# EAGLE design D1 Breakout - LCD TH Dupont (EAGLE 7.3.0)
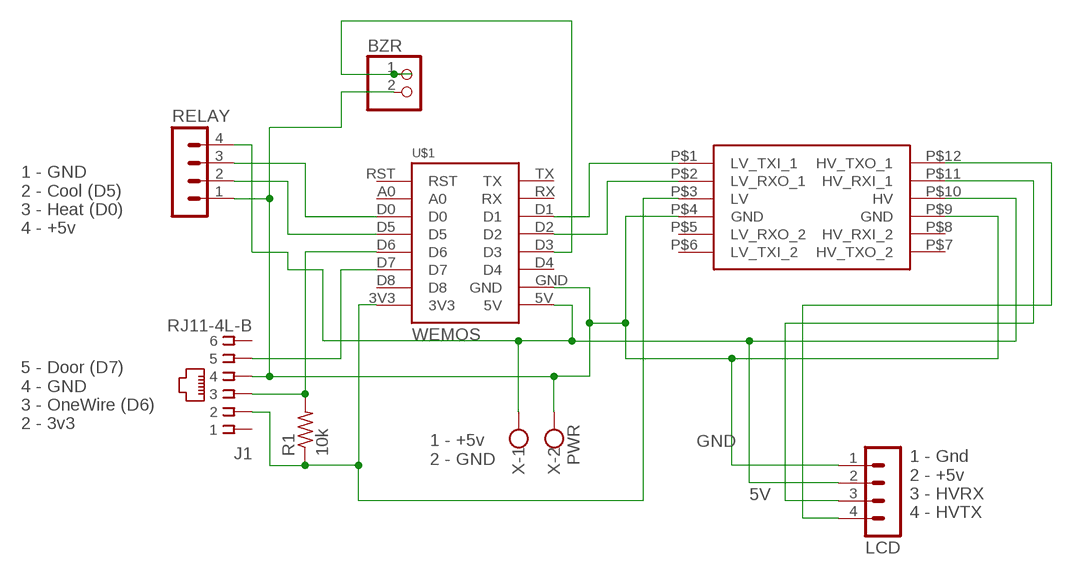
[diagram p0: schematic, sheet 1]

## Parts
BZR  PINHD-1X2  [1X02]
J1  RJ11-4L-B  [RJ11-NO_SHIELD]
LCD  MA04-1  [MA04-1]
R1  10k  R-US_0207/5V  [0207/5V]
RELAY  MA04-1  [MA04-1]
U$1  WEMOS  [WEMOS]
U$3  LOGIC_LEVEL_CONVERTER  [LOGIC_LEVEL_CONVERTER]
X  PWR  W237-102  [W237-102]

## Nets
5V [5v]: LCD.2 RELAY.4 U$1.5V U$3.P$10(HV) X.1
D6: J1.3 R1.2 U$1.D6
D7: J1.5 U$1.D7
GND [Gnd]: BZR.2 J1.4 LCD.1 RELAY.1 U$1.GND U$3.P$4(GND) U$3.P$9(GND) X.2
N$1: U$1.D1 U$3.P$1(LV_TXI_1)
N$2: U$1.D2 U$3.P$2(LV_RXO_1)
N$3 [3v]: J1.2 R1.1 U$1.3V3 U$3.P$3(LV)
N$4: LCD.4 U$3.P$12(HV_TXO_1)
N$5: LCD.3 U$3.P$11(HV_RXI_1)
N$6: BZR.1 U$1.D3
N$7: RELAY.2 U$1.D5
N$8: RELAY.3 U$1.D0
Unconnected: J1.1 J1.6 U$1.A0 U$1.D4 U$1.D8 U$1.RST U$1.RX U$1.TX U$3.P$5(LV_RXO_2) U$3.P$6(LV_TXI_2) U$3.P$7(HV_TXO_2) U$3.P$8(HV_RXI_2)

## Notes on the sheet
- 1 - GND
  2 - Cool (D5)
  3 - Heat (D0)
  4 - +5v
- 5 - Door (D7)
  4 - GND
  3 - OneWire (D6) 
  2 - 3v3
- 1 - +5v
  2 - GND
- 1 - Gnd
  2 - +5v
  3 - HVRX
  4 - HVTX

## Library data of the parts
BZR = pinhead:PINHD-1X2: PIN HEADER
J1 = con-tycoelectronics:RJ11: CORCOM Modular RJ Jacks No Shield Source: www.tycoelectronics.com .. ENG_DS_1654001_1099_RJ_L_0507.pdf; MF: TYCO ELECTRONICS; MPN: RJ11-4L-B; OC_FARNELL: unknown; OC_NEWARK: 52K3315
LCD RELAY = con-lstb:MA04-1: PIN HEADER; OC_FARNELL: unknown; OC_NEWARK: unknown
R1 = rcl:R-US_: RESISTOR, American symbol
U$1 = 1455413453956-wemos:WEMOS
U$3 = SparkFun-Boards:LOGIC_LEVEL_CONVERTER: Logic Level Converter (3.3v - 5v) https://www.sparkfun.com/products/8745
X = con-wago-500:W237-102: WAGO SCREW CLAMP; MPN: 237-102; OC_FARNELL: unknown; OC_NEWARK: 70K9898

## Net classes
0 default: width 0.305 mm, clearance 0.305 mm
1 5v: width 0.406 mm, clearance 0.406 mm
2 3v: width 0.406 mm, clearance 0.406 mm
3 Gnd: width 0.406 mm, clearance 0.406 mm

## Board
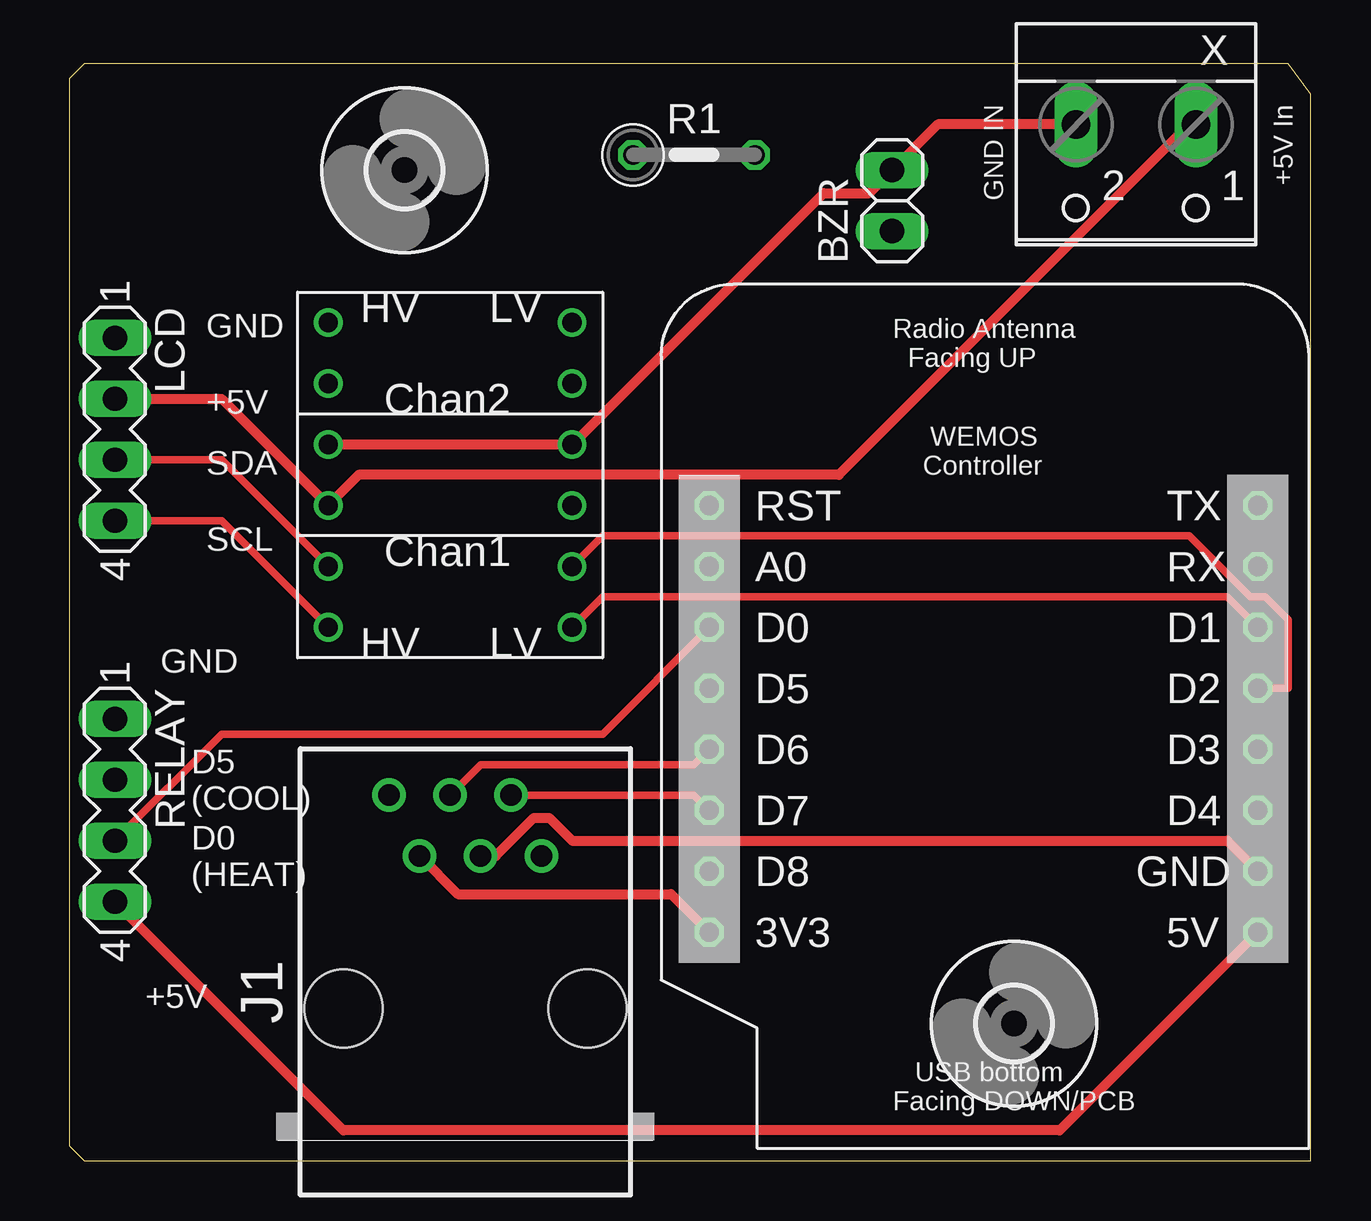
[diagram p1: board, top side]
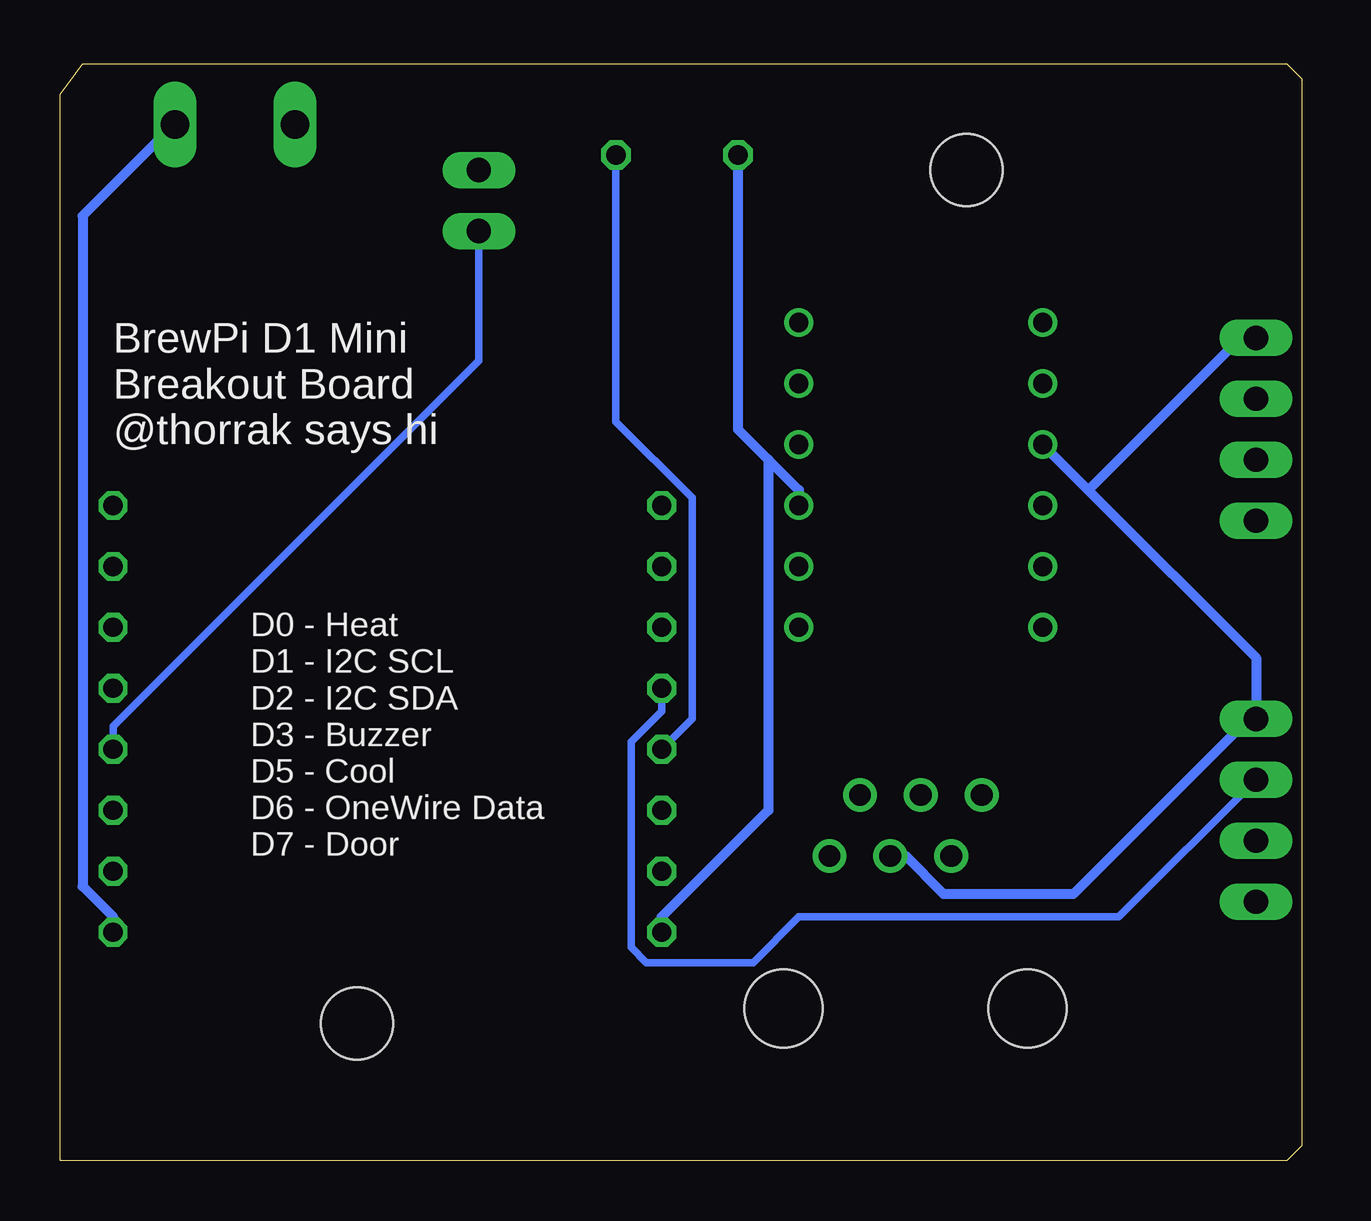
[diagram p2: board, bottom side, seen from below]

Size 51.74 x 45.72 mm. Coordinates in mm from the lower left corner, seen from the top.
Outline: 0,0.64 0.63,0 51.74,0 51.74,44.44 50.8,45.71 49.53,45.72 0.63,45.72 0,45.08 0,0.64
Copper layers (1*16): Top 0.0356mm / dielectric 1.5011mm / Bottom 0.0356mm
Design rules "PCBs_io": minimum track width 6mil, minimum drill 13mil, track to track 6mil, track to pad 6mil, pad to pad 6mil, via to via 6mil, smd to smd 6mil, copper to edge 15mil, drill to drill 6mil, minimum pad ring 7mil, minimum via ring 7mil, stop-mask expansion 3mil, vias tented up to drill 0mil, thermal gap 10mil

### Footprints (pad centres in the part's own frame; a part is rotated, then mirrored left to right if it is on the bottom)
1X02 = drill 1.016 long: 1 -1.27,0; 2 1.27,0
RJ11-NO_SHIELD = drill 0.9 pad 1.4: 1 -3.175,8.89; 2 -1.905,6.35; 3 -0.635,8.89; 4 0.635,6.35; 5 1.905,8.89; 6 3.175,6.35 | hole 3.251: -5.08,0; 5.08,0
MA04-1 = drill 1.016 long: 1 -3.81,0; 2 -1.27,0; 3 1.27,0; 4 3.81,0
0207/5V = drill 0.813 octagon: 1 -2.54,0; 2 2.54,0
WEMOS = drill 0.8 octagon: 3V3 0,0; 5V 22.86,0; A0 0,15.24; D0 0,12.7; D1 22.86,12.7; D2 22.86,10.16; D3 22.86,7.62; D4 22.86,5.08; D5 0,10.16; D6 0,7.62; D7 0,5.08; D8 0,2.54; GND 22.86,2.54; RST 0,17.78; RX 22.86,15.24; TX 22.86,17.78
3,0 = hole 3: 0,0
LOGIC_LEVEL_CONVERTER = drill 0.8: P$1 1.27,13.97; P$2 1.27,11.43; P$3 1.27,8.89; P$4 1.27,6.35; P$5 1.27,3.81; P$6 1.27,1.27; P$7 11.43,1.27; P$8 11.43,3.81; P$9 11.43,6.35; P$10 11.43,8.89; P$11 11.43,11.43; P$12 11.43,13.97
W237-102 = drill 1.194 long: 1 -2.5,-1.27; 2 2.5,-1.27

### Placement (x,y rotation side)
BZR  34.29,40 90 top
J1  16.51,6.35 0 top
LCD  1.91,30.48 270 top
R1  26.03,41.91 0 top
RELAY  1.91,14.61 270 top
U$1  26.67,9.53 0 top
U$2  [3,0]  13.97,41.27 0 top
U$3  22.23,36.19 180 top
U$4  [3,0]  39.37,5.71 0 top
X  44.45,41.91 180 top

### Tracks (layer width: path | path; a pad name or v marks a point on that pad's centre or on a via)
5V
  Top 0.406: LCD.2 6.35,31.75 U$3.P$10 12.06,28.57 32.07,28.57 46.67,43.18 X.1 | RELAY.4 11.43,1.27 41.28,1.27 U$1.5V
  Bottom 0.406: U$1.5V 49.53,10.16 50.8,11.43 50.8,39.37 46.99,43.18 X.1
D6
  Top 0.305: U$1.D6 26.03,16.51 17.15,16.51 J1.3
  Bottom 0.305: R1.2 28.58,30.8 25.4,27.62 25.4,18.42 U$1.D6
D7
  Top 0.305: U$1.D7 26.03,15.24 J1.5
GND
  Top 0.406: U$1.GND 48.26,13.33 20.95,13.33 20,14.29 19.37,14.29 17.78,12.7 J1.4 | X.2 36.19,43.18 BZR.2 33.34,40.32 31.43,40.32 U$3.P$4 U$3.P$9
  Bottom 0.406: 1.91,18.73 1.91,20.96 8.89,27.94 | U$3.P$9 8.89,27.94 | LCD.1 2.54,34.29 8.89,27.94 | J1.4 16.51,12.7 14.92,11.11 9.52,11.11 1.91,18.73 | 1.91,18.73 RELAY.1
N$1
  Top 0.305: U$3.P$1 22.23,23.5 48.26,23.5 U$1.D1
N$2
  Top 0.305: U$3.P$2 22.23,26.04 46.67,26.04 49.21,23.5 49.85,23.5 50.8,22.54 50.8,19.68 U$1.D2
N$3
  Top 0.406: U$1.3V3 25.08,11.11 16.19,11.11 J1.2
  Bottom 0.406: U$3.P$3 20.95,27.94 22.23,29.21 | 22.23,29.21 23.49,30.48 R1.1 | U$1.3V3 26.67,10.16 22.23,14.61 22.23,29.21
N$4
  Top 0.305: U$3.P$12 6.35,26.67 LCD.4
N$5
  Top 0.305: U$3.P$11 6.35,29.21 LCD.3
N$6
  Bottom 0.305: U$1.D3 49.53,18.1 34.29,33.34 BZR.1
N$7
  Bottom 0.305: U$1.D5 26.67,18.73 27.94,17.46 27.94,8.89 27.3,8.25 22.86,8.25 20.95,10.16 7.62,10.16 RELAY.2
N$8
  Top 0.305: U$1.D0 22.23,17.78 6.35,17.78 RELAY.3

### Text on the board
tPlace: GND IN | +5V In | GND | +5V | SDA | SCL | GND | D5 / (COOL) | D0 / (HEAT) | +5V
bNames: BrewPi D1 Mini / Breakout Board / @thorrak says hi | D0 - Heat / D1 - I2C SCL / D2 - I2C SDA / D3 - Buzzer / D5 - Cool / D6 - OneWire Data / D7 - Door